# EAGLE design Hub (EAGLE 7.6.0)
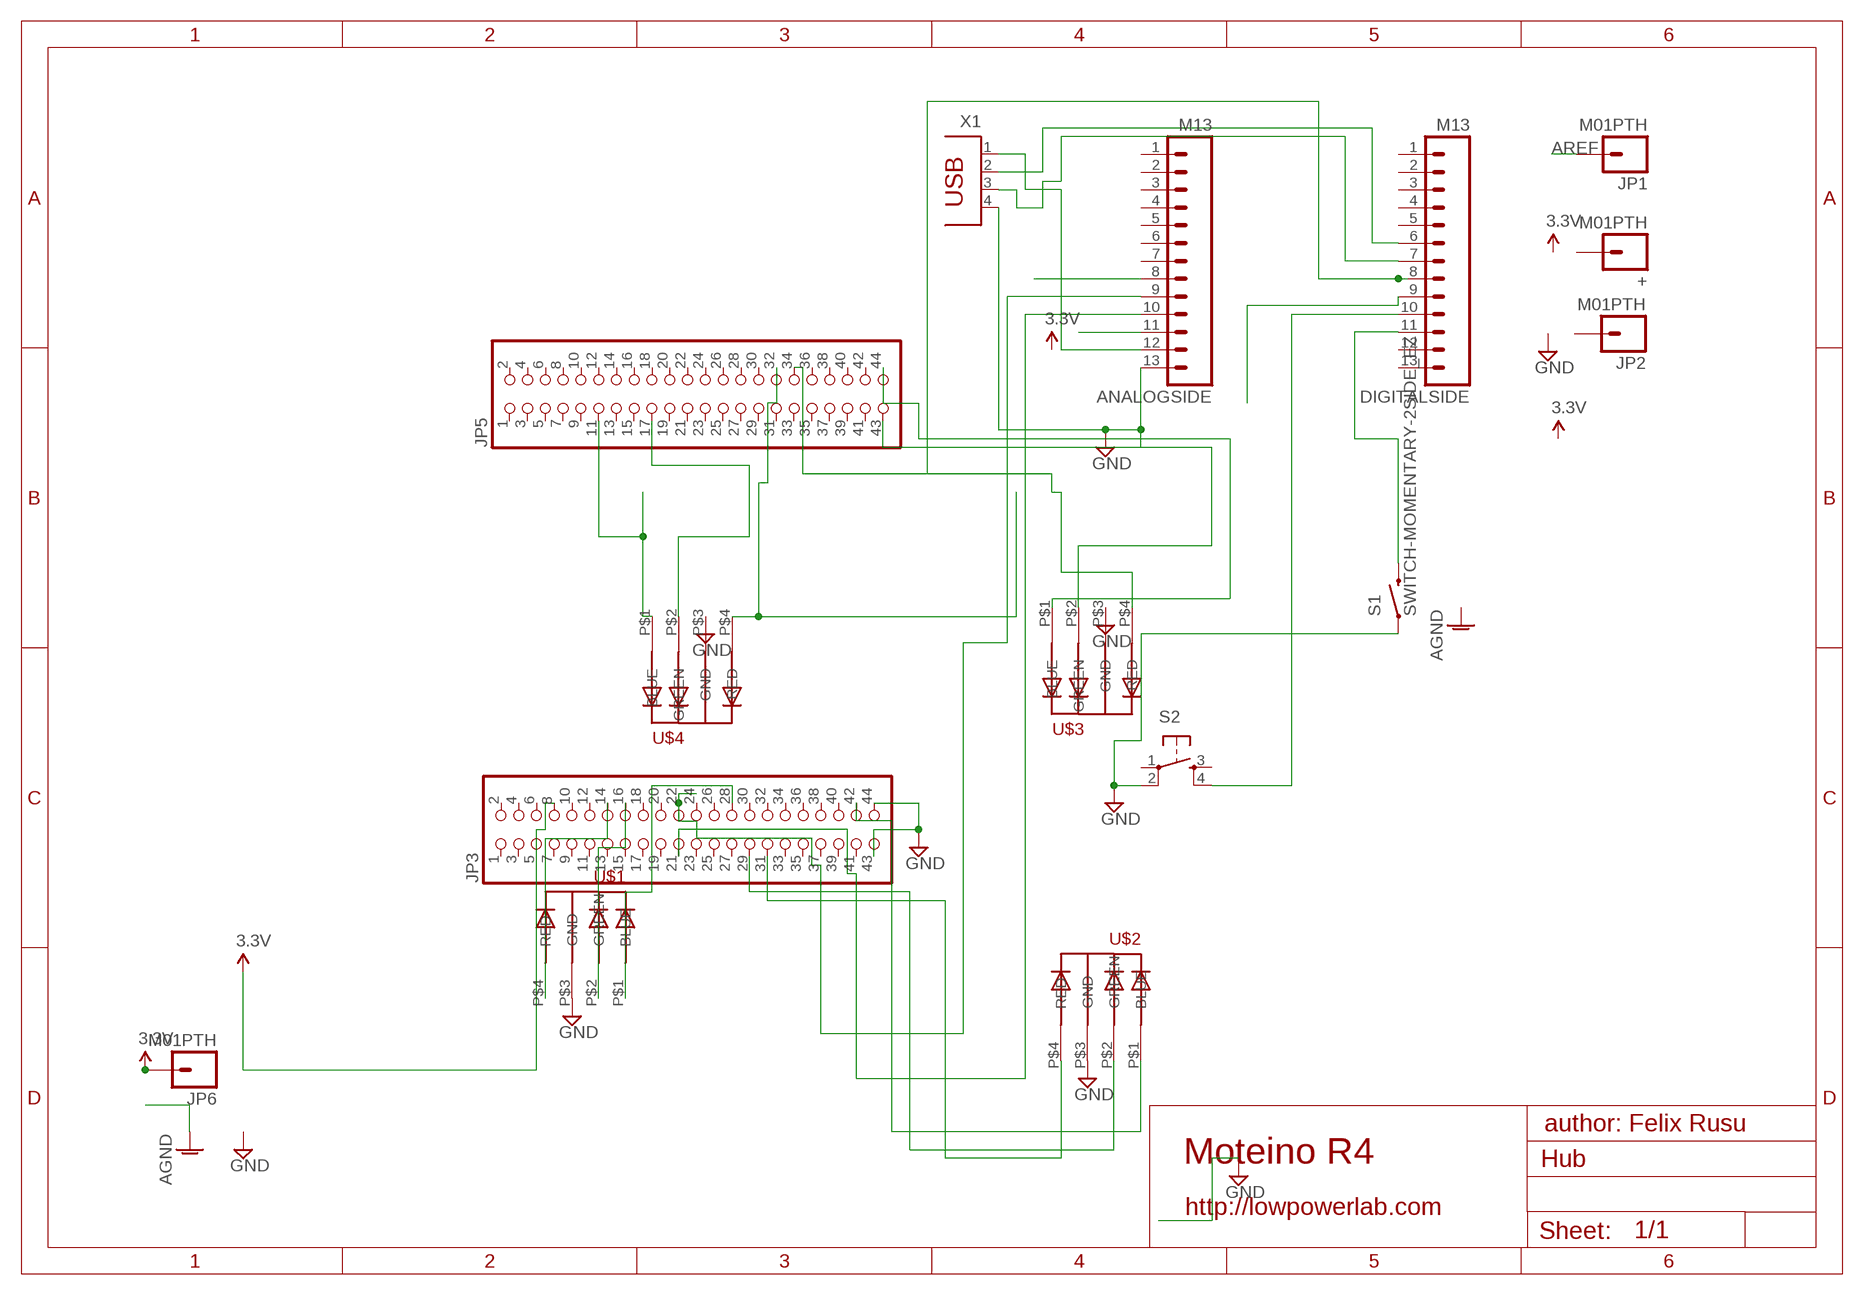
[diagram p0: schematic, sheet 1]

## Parts
+  M01PTH  [1X01]
ANALOGSIDE  M13  [1X13]
DIGITALSIDE  M13  [1X13]
JP1  M01PTH  [1X01]
JP2  M01PTH  [1X01]
JP3  PINHD-2X22  [2X22]
JP5  PINHD-2X22  [2X22]
JP6  M01PTH  [1X01]
S1  SWITCH-MOMENTARY-2SIDE_EZ  [TACTILE-PTH-SIDEEZ]
S2  TAC_SWITCHPTH  [TACTILE-PTH]
U$1  5MMRGBLED  [LED5MMRGB]
U$2  5MMRGBLED  [LED5MMRGB]
U$3  5MMRGBLED  [LED5MMRGB]
U$4  5MMRGBLED  [LED5MMRGB]
X1  PN87520  [PN87520]

## Nets
AREF: JP1.1
GND [power]: ANALOGSIDE.13 JP3.43 JP3.44 S1.1 S2.2 U$1.P$3(GND) U$2.P$3(GND) U$3.P$3(GND) U$4.P$3(GND) X1.4
N$1: DIGITALSIDE.10 S2.4
N$3: DIGITALSIDE.9
N$4: ANALOGSIDE.11
N$5: JP3.14 U$1.P$4(RED)
N$6: ANALOGSIDE.8
N$7: JP3.28 U$1.P$1(BLUE)
N$8: JP3.16 U$1.P$2(GREEN)
N$9: DIGITALSIDE.8
N$10: DIGITALSIDE.11 S1.2
N$11: JP3.42 U$2.P$1(BLUE)
N$12: ANALOGSIDE.9 JP3.22
N$13: JP3.29 U$2.P$2(GREEN)
N$14: JP3.31 U$2.P$4(RED)
N$15: JP5.11 U$4.P$1(BLUE)
N$16: JP5.17 U$4.P$2(GREEN)
N$17: JP5.32 U$4.P$4(RED)
N$19: JP5.43 U$3.P$2(GREEN)
N$20: JP5.44 U$3.P$1(BLUE)
N$21: JP5.34 U$3.P$4(RED)
N$22: ANALOGSIDE.10 JP3.21
N$23: DIGITALSIDE.7 X1.3
N$24: ANALOGSIDE.12 X1.1
N$25: DIGITALSIDE.6 X1.2
VCC: JP3.8 JP6.1 ; supply symbol labelled 3.3V
Unconnected: +.1 ANALOGSIDE.1 ANALOGSIDE.2 ANALOGSIDE.3 ANALOGSIDE.4 ANALOGSIDE.5 ANALOGSIDE.6 ANALOGSIDE.7 DIGITALSIDE.1 DIGITALSIDE.2 DIGITALSIDE.3 DIGITALSIDE.4 DIGITALSIDE.5 DIGITALSIDE.12 DIGITALSIDE.13 JP2.1 JP3.1 JP3.2 JP3.3 JP3.4 JP3.5 JP3.6 JP3.7 JP3.9 JP3.10 JP3.11 JP3.12 JP3.13 JP3.15 JP3.17 JP3.18 JP3.19 JP3.20 JP3.23 JP3.24 JP3.25 JP3.26 JP3.27 JP3.30 JP3.32 JP3.33 JP3.34 JP3.35 JP3.36 JP3.37 JP3.38 JP3.39 JP3.40 JP3.41 JP5.1 JP5.2 JP5.3 JP5.4 JP5.5 JP5.6 JP5.7 JP5.8 JP5.9 JP5.10 JP5.12 JP5.13 JP5.14 JP5.15 JP5.16 JP5.18 JP5.19 JP5.20 JP5.21 JP5.22 JP5.23 JP5.24 JP5.25 JP5.26 JP5.27 JP5.28 JP5.29 JP5.30 JP5.31 JP5.33 JP5.35 JP5.36 JP5.37 JP5.38 JP5.39 JP5.40 JP5.41 JP5.42 S2.1 S2.3

## Notes on the sheet
- author: Felix Rusu
- Moteino R4
- http://lowpowerlab.com

## Library data of the parts
+ JP1 JP2 JP6 = SparkFun-Connectors:M01: Header 1 Standard 1-pin 0.1" header. Use with straight break away headers (SKU : PRT-00116), right angle break away headers (PRT-00553), swiss pins (PRT-00743), machine pins (PRT-00117), and female headers (PRT-00115).
ANALOGSIDE DIGITALSIDE = SparkFun-Connectors:M13: 13-pin single row .1" header
JP3 JP5 = pinhead:PINHD-2X22: PIN HEADER
S1 = SparkFun-Electromechanical:SWITCH-MOMENTARY-2: Various NO switches- pushbuttons, reed, etc
S2 = SparkFun-Retired:TAC_SWITCH: Momentary Switch Button commonly used for reset or general input. Spark Fun Electronics SKU : COM-00097 SMT- SWCH-08247
U$1-U$4 = led_rgb:5MMRGBLED
X1 = con-berg:PN87520: BERG USB connector; OC_FARNELL: unknown; OC_NEWARK: unknown

## Net classes
1 power: width 0.381 mm, clearance 0.254 mm

## Board
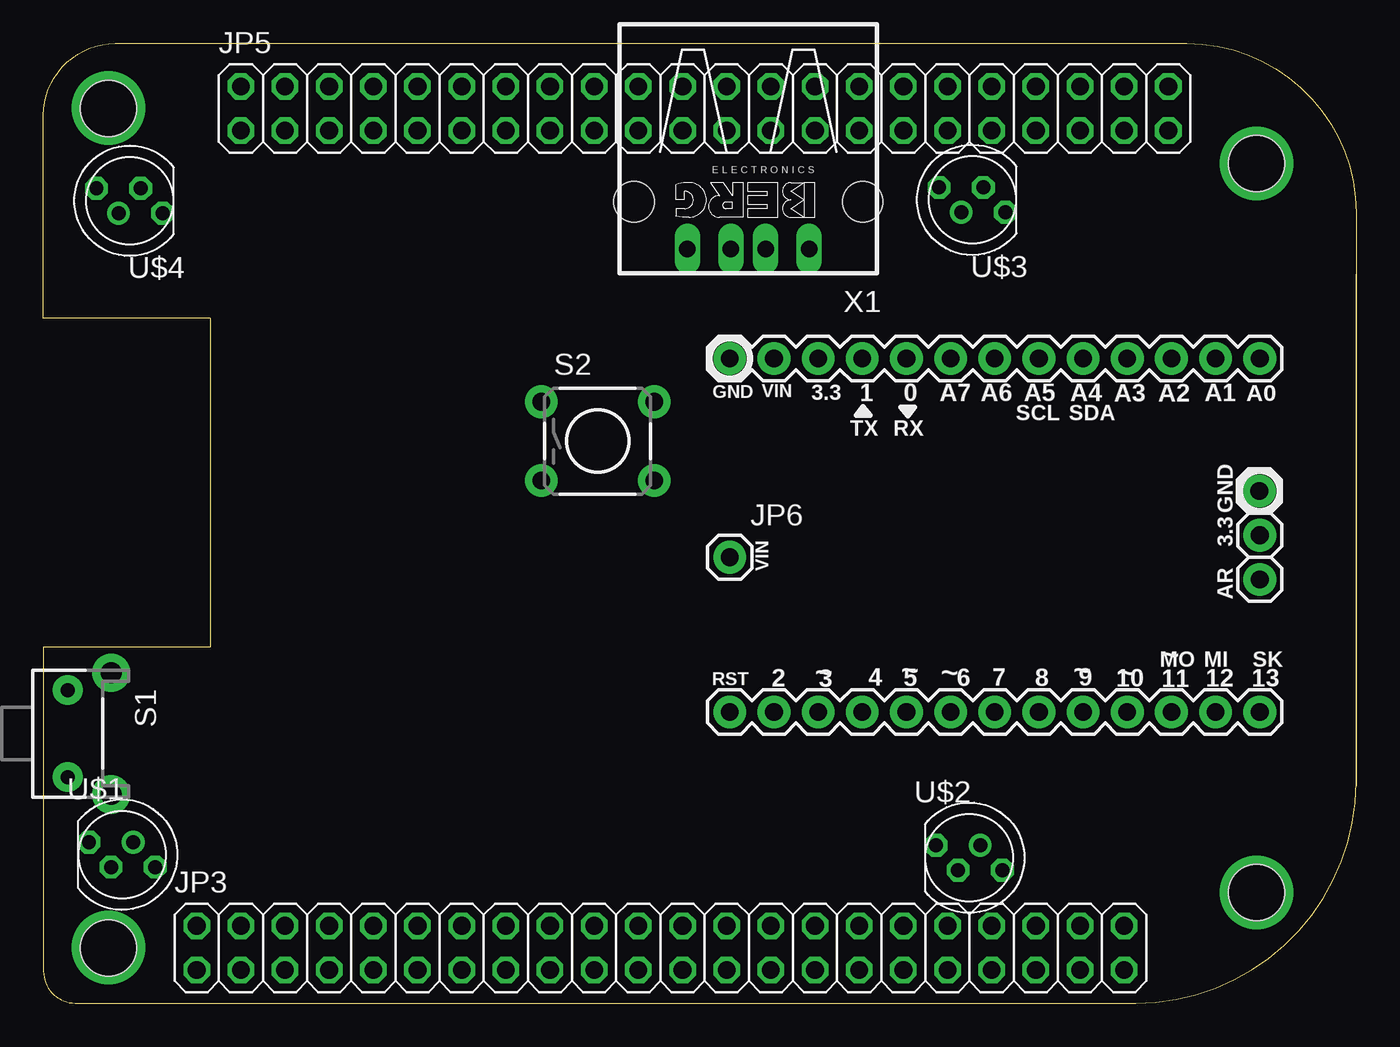
[diagram p1: board, top side]
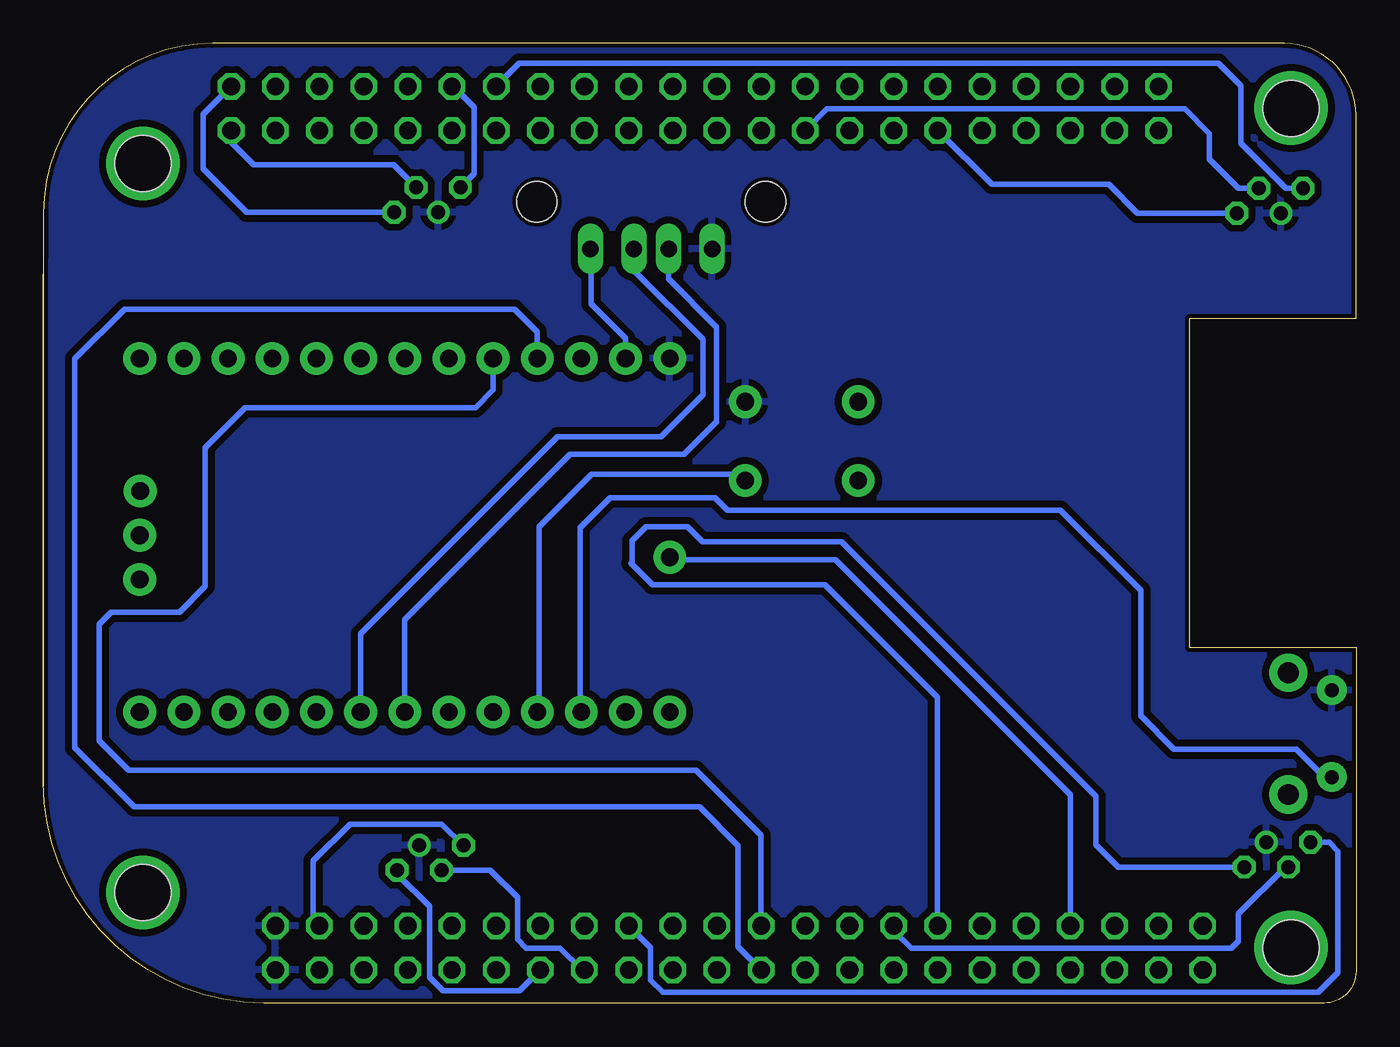
[diagram p2: board, bottom side, seen from below]

Size 75.49 x 55.17 mm. Coordinates in mm from the lower left corner, seen from the top.
Outline: 75.49,41.91 75.49,12.7 arc-90 62.81,0 1.83,0 arc-90 0,1.83
Outline: 75.49,12.5 75.49,45.44 arc90 65.76,55.17 4.14,55.17 arc90 0,51.03 0,39.37 9.58,39.37 9.58,20.45 0,20.45 0,1.83
Outline: 0,1.83 0,1.8
Copper layers (1*16): Top 0.035mm / dielectric 1.5mm / Bottom 0.035mm
Design rules "ITEADstudio_DRC *": minimum track width 6mil, minimum drill 12mil, track to track 16mil, track to pad 6mil, pad to pad 6mil, via to via 6mil, smd to smd 0mil, copper to edge 10mil, drill to drill 10mil, minimum pad ring 10mil, minimum via ring 6mil, stop-mask expansion 2mil, vias tented up to drill 100mil, thermal gap 15mil
Holes 3.2 mm at 3.73,51.44 3.73,3.17 69.77,6.35 69.77,48.26

### Footprints (pad centres in the part's own frame; a part is rotated, then mirrored left to right if it is on the bottom)
1X01 = drill 1.016 pad 1.88: 1 0,0
1X13 = drill 1.016 pad 1.88: 1 0,0; 2 2.54,0; 3 5.08,0; 4 7.62,0; 5 10.16,0; 6 12.7,0; 7 15.24,0; 8 17.78,0; 9 20.32,0; 10 22.86,0; 11 25.4,0; 12 27.94,0; 13 30.48,0
2X22 = drill 1.016 octagon: 1 -25.4,-1.27; 2 -25.4,1.27; 3 -22.86,-1.27; 4 -22.86,1.27; 5 -20.32,-1.27; 6 -20.32,1.27; 7 -17.78,-1.27; 8 -17.78,1.27; 9 -15.24,-1.27; 10 -15.24,1.27; 11 -12.7,-1.27; 12 -12.7,1.27; 13 -10.16,-1.27; 14 -10.16,1.27; 15 -7.62,-1.27; 16 -7.62,1.27; 17 -5.08,-1.27; 18 -5.08,1.27; 19 -2.54,-1.27; 20 -2.54,1.27; 21 0,-1.27; 22 0,1.27; 23 2.54,-1.27; 24 2.54,1.27; 25 5.08,-1.27; 26 5.08,1.27; 27 7.62,-1.27; 28 7.62,1.27; 29 10.16,-1.27; 30 10.16,1.27; 31 12.7,-1.27; 32 12.7,1.27; 33 15.24,-1.27; 34 15.24,1.27; 35 17.78,-1.27; 36 17.78,1.27; 37 20.32,-1.27; 38 20.32,1.27; 39 22.86,-1.27; 40 22.86,1.27; 41 25.4,-1.27; 42 25.4,1.27; 43 27.94,-1.27; 44 27.94,1.27
TACTILE-PTH-SIDEEZ = drill 0.8 pad 1.7: 1 -2.5,0; 2 2.5,0 | drill 1.2 pad 2.2: ANCHOR1 -3.5,2.5; ANCHOR2 3.5,2.5
TACTILE-PTH = drill 1.016 pad 1.88: 1 -3.251,2.261; 2 3.251,2.261; 3 -3.251,-2.261; 4 3.251,-2.261
LED5MMRGB = drill 0.8 pad 0.813 octagon: P$1 -1.905,0.714; P$2 -0.635,-0.714; P$4 1.905,-0.714 | drill 0.8 pad 0.813: P$3 0.635,0.714
PN87520 = drill 0.95 long: 1 -3.5,2.71; 2 -1,2.71; 3 1,2.71; 4 3.5,2.71 | hole 2.3: -6.57,0; 6.57,0

### Placement (x,y rotation side)
+  69.95,26.9 270 top
ANALOGSIDE  69.95,37.06 180 top
DIGITALSIDE  69.95,16.74 180 top
JP1  69.95,24.36 0 top
JP2  69.93,29.44 0 top
JP3  34.21,3.17 0 top
JP5  36.75,51.44 0 top
JP6  39.47,25.63 0 top
S1  1.4,15.49 270 top
S2  31.88,32.31 0 top
U$1  4.52,8.53 0 top
U$2  53.24,8.36 0 top
U$3  53.42,46.18 180 top
U$4  4.95,46.13 180 top
X1  40.54,46.08 180 top

### Tracks (layer width: path | path; a pad name or v marks a point on that pad's centre or on a via)
GND
  pour Bottom: -0.46,55.12 74.93,54.89 75.39,-0.41 -0.25,-0.18
N$1
  Bottom 0.305: 47.02,16.81 DIGITALSIDE.10 46.99,16.84 46.99,27.38 43.97,30.4 35.48,30.4 S2.4
N$5
  Bottom 0.305: U$1.P$4 6.45,7.8 13.67,7.8 14.96,9.09 14.96,11.89 29.59,26.52 37.59,26.52 38.46,27.38 40.84,27.38 41.63,26.59 41.63,25.37 41.71,25.3 40.46,24.05 30.56,24.05 24.08,17.58 24.08,4.47 JP3.14
N$7
  Bottom 0.305: U$1.P$1 1.55,9.25 1.04,8.74 1.04,1.75 2.18,0.61 39.85,0.61 40.56,1.32 40.56,3.18 JP3.28
N$8
  Bottom 0.305: U$1.P$2 4.07,7.82 6.76,5.13 6.76,3.56 7.16,3.15 25.58,3.15 26.59,4.17 JP3.16
N$10
  Bottom 0.305: S1.2 1.82,12.99 3.43,14.61 10.47,14.61 12.37,16.51 12.37,23.72 16.99,28.35 36.14,28.35 36.86,29.06 42.9,29.06 44.63,27.33 44.63,16.81 DIGITALSIDE.11
N$11
  Bottom 0.305: U$2.P$1 51.36,9.07 52.58,10.29 57.86,10.29 59.97,8.18 59.97,4.8 JP3.42
N$12
  Bottom 0.305: ANALOGSIDE.9 49.63,35.26 50.65,34.24 63.88,34.24 66.19,31.93 66.19,23.95 67.67,22.48 71.6,22.48 72.29,21.79 72.29,15.09 70.59,13.39 37.95,13.39 34.21,9.65 JP3.22
N$13
  Bottom 0.305: 44.53,1.91 45.77,3.15 47.73,3.15 48.23,3.66 48.23,6.07 49.81,7.65 U$2.P$2
  Bottom 0.406: JP3.29 44.53,1.91 | U$2.P$2
N$14
  Bottom 0.305: 55.14,7.42 53.29,5.56 53.29,1.5 52.5,0.71 48.11,0.71 JP3.31
  Bottom 0.406: U$2.P$4 55.14,7.42
N$15
  Bottom 0.305: U$4.P$1 12.57,45.41 14.22,47.07 20.96,47.07 JP5.11
N$16
  Bottom 0.305: U$4.P$2 6.76,46.84 8.43,48.51 8.43,49.99 9.86,51.41 30.43,51.41 JP5.17
N$17
  Bottom 0.305: U$4.P$4 4.04,46.84 6.63,49.43 6.63,52.73 7.93,54.03 48.13,54.03 JP5.32
N$18  (via drill 3.2)
  other vias: 3.73,51.46
N$19
  Bottom 0.305: U$3.P$2 55.34,48.18 63.4,48.18 64.69,49.48 JP5.43
N$20
  Bottom 0.305: U$3.P$1 63.8,45.46 66.29,47.96 66.29,51.1 JP5.44
N$21
  Bottom 0.305: U$3.P$4 50.72,47.68 50.72,51.51 51.92,52.71
  Bottom 0.406: 51.92,52.71 JP5.34
N$22
  Bottom 0.305: ANALOGSIDE.10 47.09,38.61 48.39,39.9 70.82,39.9 73.69,37.03 73.69,14.68 70.28,11.28 37.77,11.28 35.53,9.04 35.53,3.23 JP3.21
N$23
  Bottom 0.305: X1.3 39.55,41.63 36.78,38.86 36.78,33.43 38.66,31.55 45.21,31.55 54.71,22.05 DIGITALSIDE.7
N$24
  Bottom 0.305: ANALOGSIDE.12 42.01,38.23 43.99,40.21 43.99,43.32 X1.1
N$25
  Bottom 0.305: X1.2 41.4,43.23 41.4,42.75 41.45,42.7 41.45,42.04 37.57,38.15 37.57,34.98 39.98,32.56 45.92,32.56 57.25,21.23 DIGITALSIDE.6
N$26  (via drill 3.2)
  other vias: 3.73,3.2
N$27  (via drill 3.2)
  other vias: 69.77,6.35
N$28  (via drill 3.2)
  other vias: 69.77,48.26
VCC
  Bottom 0.305: 39.45,25.6 JP6.1 39.32,25.48 29.95,25.48 16.43,11.96 JP3.8

### Text on the board
_tsilk: GND | VIN | 3.3 | 1 | 0 | A7 | A6 | A5 | A4 | A3 | A2 | A1 | A0 | TX | RX | SCL | SDA | GND | 3.3 | VIN | AR | 2 | 3 | 4 | 5 | 6 | 7 | 8 | 9 | 10 | MO | ~ | 11 | MI | 12 | SK | 13 | RST | ~ | ~ | ~ | ~ | ~